# Altium schematic sheet 02_sensor.SchDoc
size A3; SheetNumber: 3; SheetTotal: 4
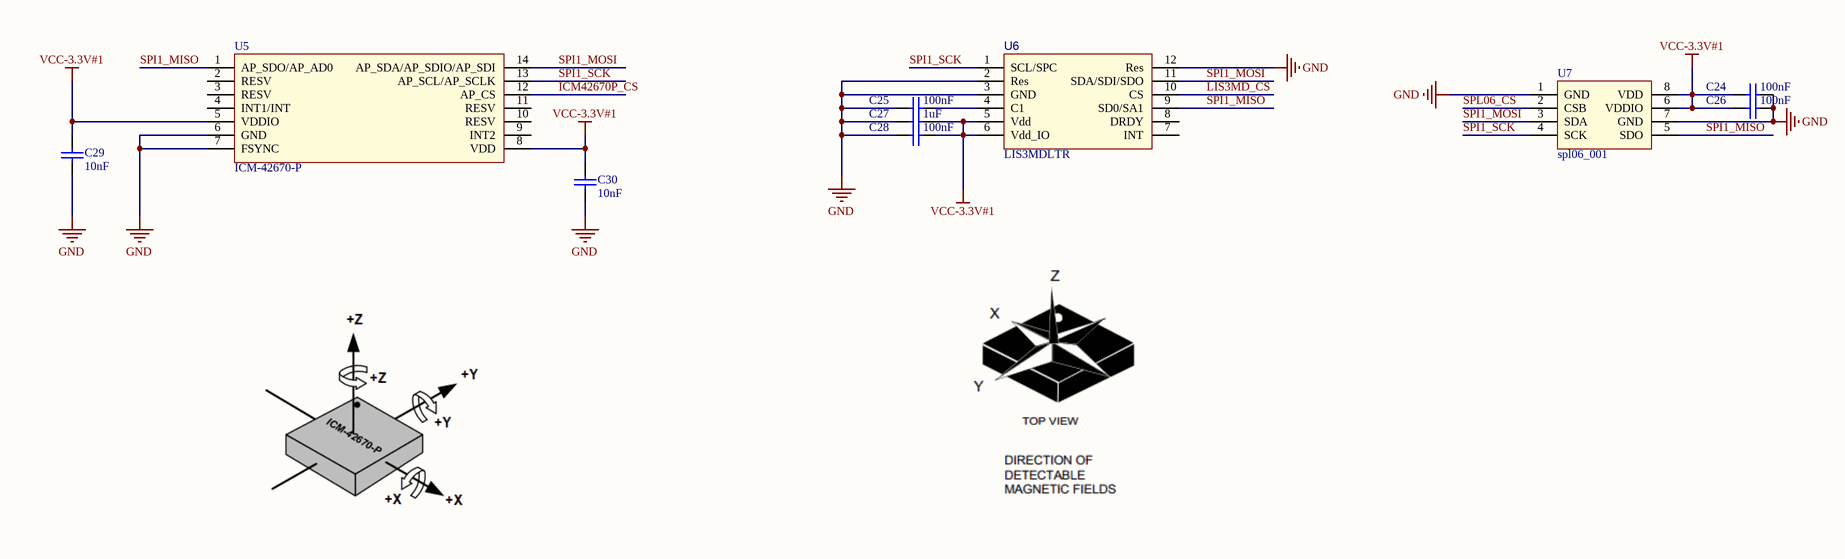
[diagram p0: 02_sensor.SchDoc]

## Parts
C24  100nF  [0603-C]
C25  100nF  [0603-C]
C26  100nF  [0603-C]
C27  1uF  [0603-C]
C28  100nF  [0603-C]
C29  10nF  [0603-C]
C30  10nF  [0603-C]
U5  ICM-42670-P  [ICM42670P]
U6  LIS3MDLTR  [LIS3MDLTR]
U7  spl06_001  [SPL06]

## Nets
GND: C24.2 C25.1 C26.2 C27.1 C28.1 C29.1 C30.1 U5.6(GND) U5.7(FSYNC) U6.2(Res) U6.3(GND) U6.12(Res) U7.1(GND) U7.7(GND)
VCC-3.3V#1: C24.1 C26.1 C27.2 C28.2 C29.2 C30.2 U5.5(VDDIO) U5.8(VDD) U6.5(Vdd) U6.6(Vdd_IO) U7.6(VDDIO) U7.8(VDD)
ICM42670P_CS: U5.12(AP_CS)
LIS3MD_CS: U6.10(CS)
SPI1_MISO: U5.1(AP_SDO/AP_AD0) U6.9(SD0/SA1) U7.5(SDO)
SPI1_MOSI: U5.14(AP_SDA/AP_SDIO/AP_SDI) U6.11(SDA/SDI/SDO) U7.3(SDA)
SPI1_SCK: U5.13(AP_SCL/AP_SCLK) U6.1(SCL/SPC) U7.4(SCK)
SPL06_CS: U7.2(CSB)
NetC25_2: C25.2 U6.4(C1)

Not connected (* = marked no-connect by the designer): U5 2(RESV) 3(RESV) 4(INT1/INT) 9(INT2) 10(RESV) 11(RESV); U6 7(INT) 8(DRDY)

## Library data of the parts
C24-C30 = C: 贴片电容; BOM名称: 无极性贴片电容; 联系卖家，免费查找封装: 唯一出售店铺网址https://shop463601444.taobao.com
U5 = ICM-42670-P: Manufacturer: TDK InvenSense(应美盛); Add into BOM: yes; Sensor Type: 加速度计陀螺仪; Symbol: ICM-42670-P; Device: ICM-42670-P; Supplier: LCSC; Supplier Part: C3288646; Manufacturer Part: ICM-42670-P; JLCPCB Part Class: 扩展库; LCSC Part Name: ICM-42670-P; Supplier Footprint: LGA-14(2.5x3); Datasheet: /pdf/applyPasteComponent/2023-06-06/453894A/f777f4f41a0e4ea2b93b88a9675b1ac5/ICM-42670-P.pdf; Convert to PCB: yes; Operating Temperature: -40℃~+85℃; Name: ICM-42670-P
U6 = LIS3MDLTR: Manufacturer: ST(意法半导体); Add into BOM: yes; supply voltage: 1.9V~3.6V; Symbol: LIS3MDLTR; Device: LIS3MDLTR; Supplier: LCSC; Supplier Part: C478483; Manufacturer Part: LIS3MDLTR; JLCPCB Part Class: Extended Part; LCSC Part Name: 三轴数字磁传感器; Supplier Footprint: LGA-12(2x2); Datasheet: https://atta.szlcsc.com/upload/public/pdf/source/20191231/C478483_325C07DDDEF2D93C2E541FB70AD6AC5C.pdf; Convert to PCB: yes; Operating Temperature: -40℃~+85℃
U7 = SPL06_001: 气压计